# Altium schematic sheet MCU.SchDoc
size A4; SheetNumber: 4; SheetTotal: 5
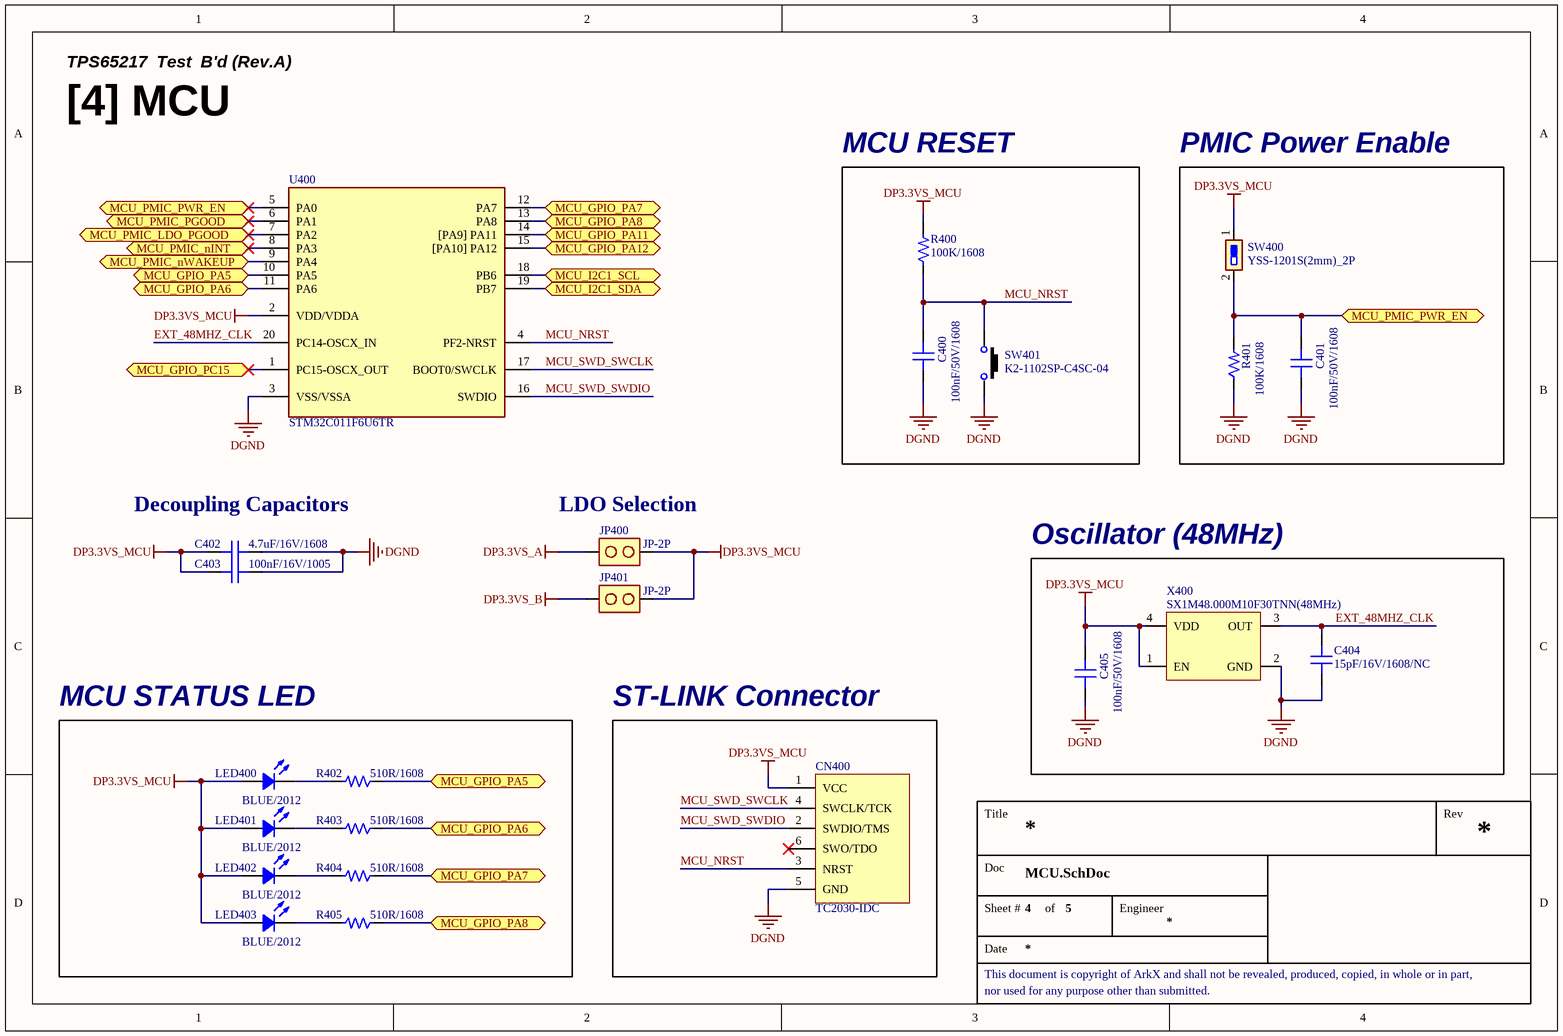
[diagram p0: MCU.SchDoc]

## Parts
C400  100nF/50V/1608  [CAP 1608 (0603_INCH)]
C401  100nF/50V/1608  [CAP 1608 (0603_INCH)]
C402  4.7uF/16V/1608  [CAP 1608 (0603_INCH)]
C403  100nF/16V/1005  [CAP 1005 (0402_INCH)]
C404  15pF/16V/1608/NC  [CAP 1608 (0603_INCH)/NC]
C405  100nF/50V/1608  [CAP 1608 (0603_INCH)]
CN400  TC2030-IDC  [CON_TC2030-IDC]  (no BOM)
JP400  JP-2P  [CON PIN_HEADER-2PIN(2.54MM)]
JP401  JP-2P  [CON PIN_HEADER-2PIN(2.54MM)]
LED400  BLUE/2012  [LED MHT170RGBCT (BLUE)]
LED401  BLUE/2012  [LED MHT170RGBCT (BLUE)]
LED402  BLUE/2012  [LED MHT170RGBCT (BLUE)]
LED403  BLUE/2012  [LED MHT170RGBCT (BLUE)]
R400  100K/1608  [RES 1608 (0603_inch)]
R401  100K/1608  [RES 1608 (0603_inch)]
R402  510R/1608  [RES 1608 (0603_inch)]
R403  510R/1608  [RES 1608 (0603_inch)]
R404  510R/1608  [RES 1608 (0603_inch)]
R405  510R/1608  [RES 1608 (0603_inch)]
SW400  YSS-1201S(2mm)_2P  [SW YSS-1201S-2mm]
SW401  K2-1102SP-C4SC-04  [SW K2-1102SP-C4SC-04]
U400  STM32C011F6U6TR  [IC_UFQFPN-20]
X400  SX1M48.000M10F30TNN(48MHz)  [OSC_SMD2016-4P]

## Blocks framed on the sheet
MCU RESET: C400 R400 SW401
PMIC Power Enable: C401 R401 SW400
Oscillator (48MHz): C404 C405 X400
MCU STATUS LED: LED400-LED403 R402-R405
ST-LINK Connector: CN400

## Ports
MCU_GPIO_PA5 (bidir), MCU_GPIO_PA6 (bidir), MCU_GPIO_PA7 (bidir), MCU_GPIO_PA8 (bidir), MCU_GPIO_PA11 (bidir), MCU_GPIO_PA12 (bidir), MCU_GPIO_PC15 (bidir), MCU_I2C1_SCL (bidir), MCU_I2C1_SDA (bidir), MCU_PMIC_LDO_PGOOD (bidir), MCU_PMIC_nINT (bidir), MCU_PMIC_nWAKEUP (bidir), MCU_PMIC_PGOOD (bidir), MCU_PMIC_PWR_EN (bidir)

## Nets
DGND: C400.1 C401.1 C402.1 C403.1 C404.1 C405.1 CN400.5(GND) R401.1 SW401.3 U400.3(VSS/VSSA) X400.2(GND)
DP3.3VS_A: JP400.1
DP3.3VS_B: JP401.1
DP3.3VS_MCU: C402.2 C403.2 C405.2 CN400.1(VCC) JP400.2 JP401.2 LED400.4(Common_Anode) LED401.4(Common_Anode) LED402.4(Common_Anode) LED403.4(Common_Anode) R400.2 SW400.1 U400.2(VDD/VDDA) X400.1(EN) X400.4(VDD)
EXT_48MHZ_CLK: C404.2 U400.20(PC14-OSCX_IN) X400.3(OUT)
MCU_GPIO_PA5: R402.1 U400.10(PA5) ; port MCU_GPIO_PA5
MCU_GPIO_PA6: R403.1 U400.11(PA6) ; port MCU_GPIO_PA6
MCU_GPIO_PA7: R404.1 U400.12(PA7) ; port MCU_GPIO_PA7
MCU_GPIO_PA8: R405.1 U400.13(PA8) ; port MCU_GPIO_PA8
MCU_GPIO_PA11: U400.14([PA9]_PA11) ; port MCU_GPIO_PA11
MCU_GPIO_PA12: U400.15([PA10]_PA12) ; port MCU_GPIO_PA12
MCU_GPIO_PC15: U400.1(PC15-OSCX_OUT) ; port MCU_GPIO_PC15
MCU_I2C1_SCL: U400.18(PB6) ; port MCU_I2C1_SCL
MCU_I2C1_SDA: U400.19(PB7) ; port MCU_I2C1_SDA
MCU_NRST: C400.2 CN400.3(NRST) R400.1 SW401.1 U400.4(PF2-NRST)
MCU_PMIC_LDO_PGOOD: U400.7(PA2) ; port MCU_PMIC_LDO_PGOOD
MCU_PMIC_nINT: U400.8(PA3) ; port MCU_PMIC_nINT
MCU_PMIC_nWAKEUP: U400.9(PA4) ; port MCU_PMIC_nWAKEUP
MCU_PMIC_PGOOD: U400.6(PA1) ; port MCU_PMIC_PGOOD
MCU_PMIC_PWR_EN: C401.2 R401.2 SW400.2 U400.5(PA0) ; port MCU_PMIC_PWR_EN
MCU_SWD_SWCLK: CN400.4(SWCLK/TCK) U400.17(BOOT0/SWCLK)
MCU_SWD_SWDIO: CN400.2(SWDIO/TMS) U400.16(SWDIO)
NetLED400_3: LED400.3(BLUE) R402.2
NetLED401_3: LED401.3(BLUE) R403.2
NetLED402_3: LED402.3(BLUE) R404.2
NetLED403_3: LED403.3(BLUE) R405.2

Not connected (* = marked no-connect by the designer): CN400 6(SWO/TDO)*

## Notes on the sheet
- TPS65217  Test  B'd (Rev.A)
- [4] MCU
- Decoupling Capacitors
- (near JP400) LDO Selection
- Title
- Rev
- Doc
- Sheet #
- of
- Engineer
- This document is copyright of ArkX and shall not be revealed, produced, copied, in whole or in part,
- Date
- nor used for any purpose other than submitted.

## Library data of the parts
C400 C401 C405 = CAP_100nF/50V/1608: Ceramic CAP_100nF/50V/1608; LCSC Part #: C14663; JLCPCB Part Type: Basic Part
C402 = CAP_4.7uF/16V/1608: Ceramic CAP_4.7uF/16V/1608; LCSC Part #: C19666; JLCPCB Part Type: Basic Part
C403 = CAP_100nF/16V/1005: Ceramic CAP_100nF/16V/1005; LCSC Part #: C1525; JLCPCB Part Type: Basic Part
C404 = CAP_NC_15pF/16V/1608: Ceramic CAP_15pF/16V/1608
CN400 = CON_TC2030-IDC(ST-LINK): Tag-Connect No-Solder SWD Debug Connector DO NOT PLACE; Manufacturer Part Number: TC2030; Manufacturer: Tag-Connect
JP400 JP401 = CON_JP-2P
LED400-LED403 = LED_MHT170RGBCT(BLUE): Colorless transparence -30℃~+85℃ Positive post Common anode RGB 120° 0805  Light Emitting Diodes (LED) ROHS; LCSC Part #: C2962094; JLCPCB Part Type: Extended Part
R400 R401 = RES_100K/1608/0.1W: Value: 100K; Power Rating: 0.1W; Precision: 1%; Size: 1608; LCSC Part #: C25803; JLCPCB Part Type: Basic Part
R402-R405 = RES_510R/1608/0.1W: Value: 510R; Power Rating: 0.1W; Precision: 1%; Size: 1608; LCSC Part #: C23193; JLCPCB Part Type: Basic Part
SW400 = SW_YSS-1201S(2mm)_2P: SMD Slide Switch. / Rating : DC 6V/0.3A / Travel : 2MM
SW401 = SW_K2-1102SP-C4SC-04(2P): -25℃~+85℃ 6mm 5mm Round Button 50mA Brick nogging 6mm SPST 100MΩ 100000 250gf@±30gf 12V SMD  Tactile Switches ROHS; LCSC Part #: C127509; JLCPCB Part Type: Extended Part
U400 = IC_MCU_STM32C011F6U6TR: ARM® Cortex®-M0+ STM32C0 Microcontroller IC 32-Bit 48MHz 32KB (32K x 8) FLASH 20-UFQFPN (3x3); Manufacturer: STMicroelectronics; Manufacturer Part Number: STM32C011F6U6TR; Case/Package: UFQFPN20; LCSC Part #: C5456206; JLCPCB Part Type: Extended Part
X400 = OSC_SX1M48.000M10F30TNN(48MHz): 1.62V~3.63V ±10ppm CMOS 48MHz SMD2016-4P  Oscillators ROHS; LCSC Part #: C2901617; JLCPCB Part Type: Extended Part